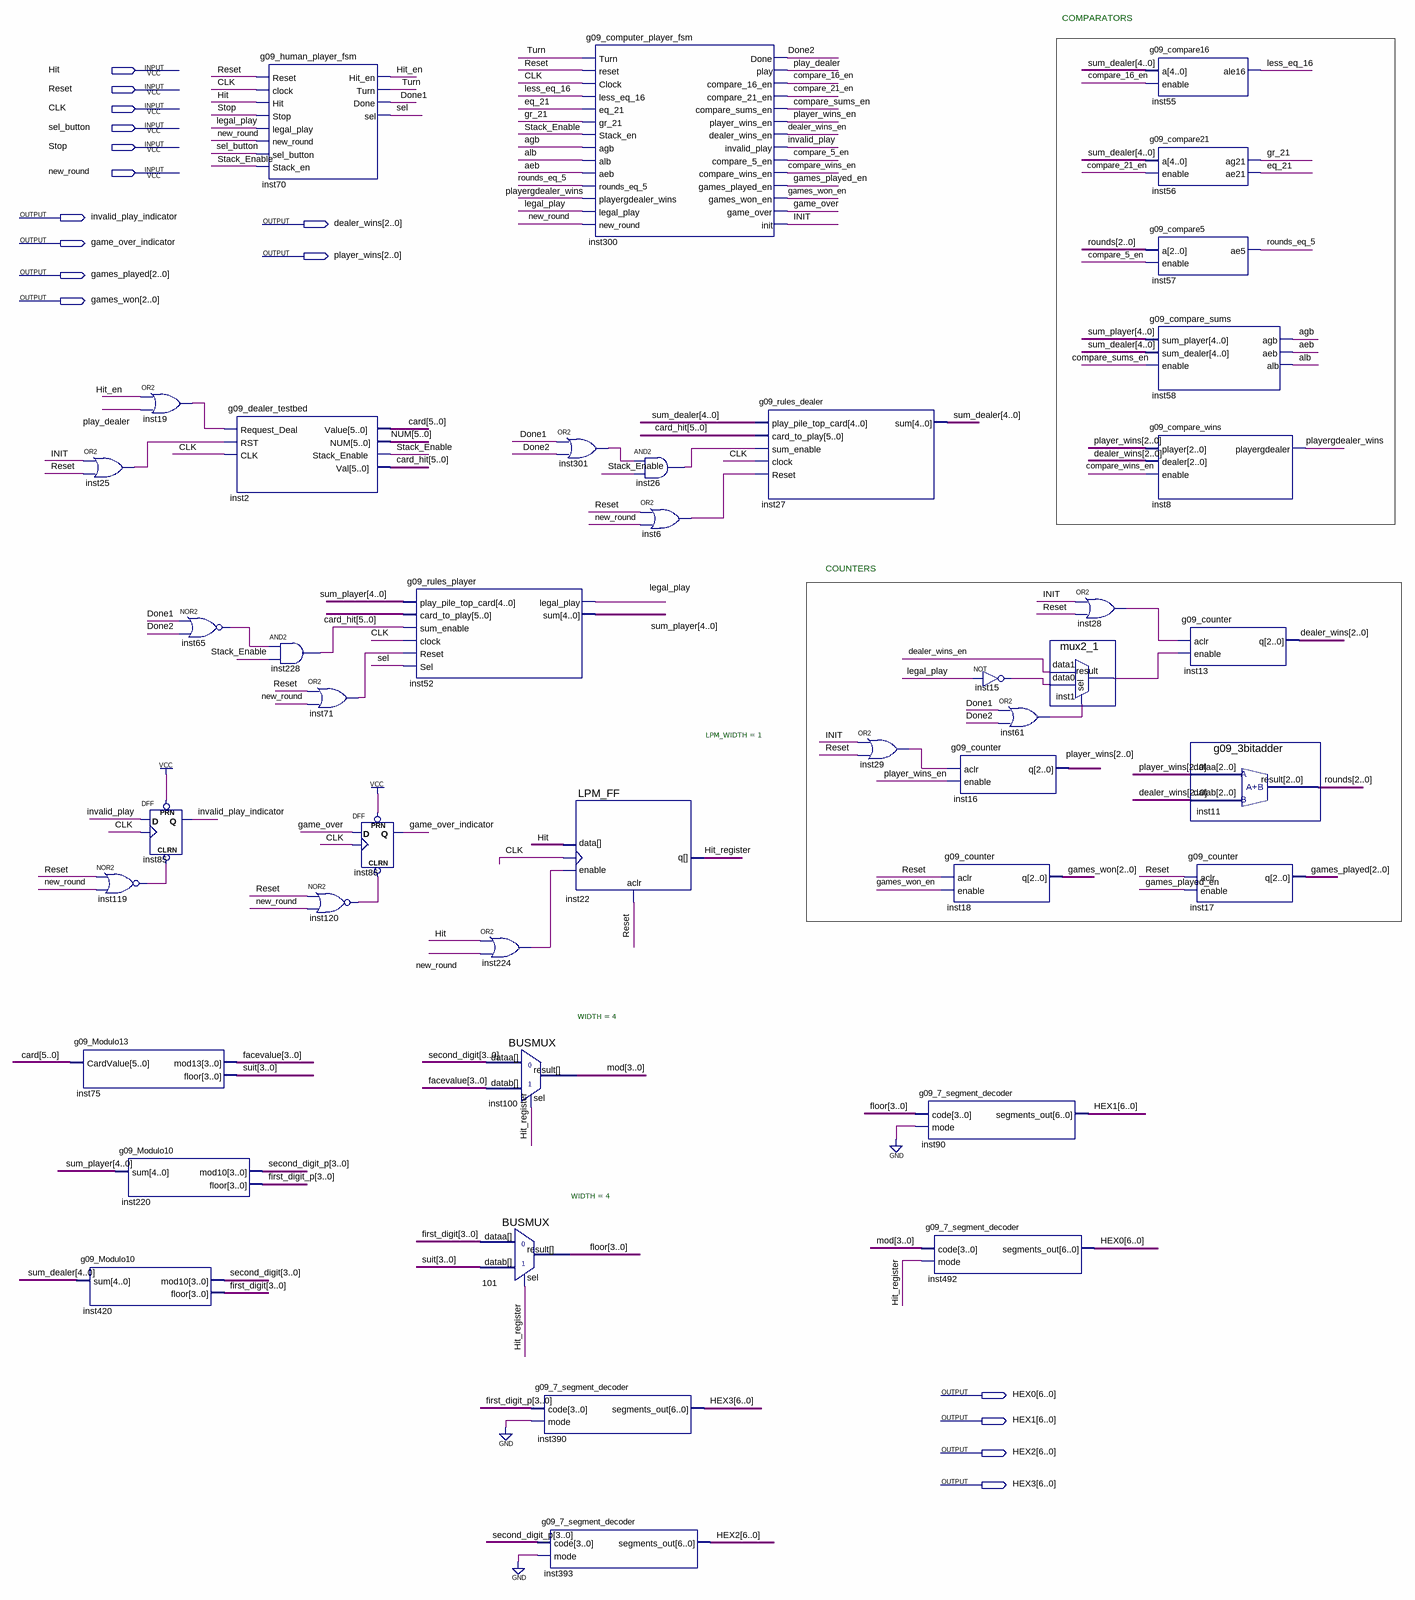
[diagram p0: schematic sheet]
// Quartus schematic g09_datapath.bdf as structural Verilog: 43 symbols, 16 pins
module g09_datapath (
  input  Hit,
  input  Reset,
  input  CLK,
  input  sel_button,
  input  Stop,
  input  new_round,
  output invalid_play_indicator,
  output [2:0] dealer_wins,
  output game_over_indicator,
  output [2:0] player_wins,
  output [2:0] games_played,
  output [2:0] games_won,
  output [6:0] HEX0,
  output [6:0] HEX1,
  output [6:0] HEX2,
  output [6:0] HEX3
);

  wire aeb, agb, alb, compare_5_en, compare_16_en, compare_21_en, compare_sums_en, compare_wins_en,
       dealer_wins_en, Done1, Done2, eq_21, game_over, games_played_en, games_won_en, gr_21, Hit_en,
       Hit_register, INIT, inst1_result, inst6_out, inst15_out, inst19_out, inst25_out, inst26_out,
       inst28_out, inst29_out, inst61_out, inst65_out, inst71_out, inst119_out, inst120_out, inst224_out,
       inst228_out, inst301_out, invalid_play, legal_play, less_eq_16, play_dealer, player_wins_en,
       playergdealer_wins, rounds_eq_5, sel, Stack_Enable, Turn;
  wire [2:0] rounds;
  wire [3:0] facevalue, first_digit, first_digit_p, floor, mod, second_digit, second_digit_p, suit;
  wire [4:0] sum_dealer, sum_player;
  wire [5:0] card, card_hit, NUM;

  or inst25 (inst25_out, INIT, Reset);
  g09_Modulo13 inst75 (.CardValue(card), .mod13(facevalue), .floor(suit));
  g09_Modulo10 inst420 (.sum(sum_dealer), .mod10(second_digit), .floor(first_digit));
  nor inst119 (inst119_out, Reset, new_round);
  g09_Modulo10 inst220 (.sum(sum_player), .mod10(second_digit_p), .floor(first_digit_p));
  or inst19 (inst19_out, Hit_en, play_dealer);
  nor inst65 (inst65_out, Done1, Done2);
  DFF inst85 (.CLRN(inst119_out), .CLK(CLK), .D(invalid_play), .PRN(1'b1), .Q(invalid_play_indicator));
  g09_dealer_testbed inst2 (
    .Request_Deal(inst19_out), .RST(inst25_out), .CLK(CLK), .Value(card), .NUM(NUM),
    .Stack_Enable(Stack_Enable), .Val(card_hit));
  g09_human_player_fsm inst70 (
    .Reset(Reset), .clock(CLK), .Hit(Hit), .Stop(Stop), .legal_play(legal_play), .new_round(new_round),
    .sel_button(sel_button), .Stack_en(Stack_Enable), .Hit_en(Hit_en), .Turn(Turn), .Done(Done1), .sel(sel));
  and inst228 (inst228_out, inst65_out, Stack_Enable);
  or inst71 (inst71_out, Reset, new_round);
  nor inst120 (inst120_out, Reset, new_round);
  DFF inst86 (.CLRN(inst120_out), .CLK(CLK), .D(game_over), .PRN(1'b1), .Q(game_over_indicator));
  g09_rules_player inst52 (
    .play_pile_top_card(sum_player), .card_to_play(card_hit), .sum_enable(inst228_out), .clock(CLK),
    .Reset(inst71_out), .Sel(sel), .legal_play(legal_play), .sum(sum_player));
  or inst224 (inst224_out, Hit, new_round);
  BUSMUX #(.WIDTH(4)) inst100 (.datab(facevalue), .sel(Hit_register), .dataa(second_digit), .result(mod));
  BUSMUX #(.WIDTH(4)) u_101 (.datab(suit), .sel(Hit_register), .dataa(first_digit), .result(floor));
  g09_7_segment_decoder inst390 (.code(first_digit_p), .mode(1'b0), .segments_out(HEX3));
  g09_7_segment_decoder inst393 (.code(second_digit_p), .mode(1'b0), .segments_out(HEX2));
  g09_computer_player_fsm inst300 (
    .Turn(Turn), .reset(Reset), .Clock(CLK), .less_eq_16(less_eq_16), .eq_21(eq_21), .gr_21(gr_21),
    .Stack_en(Stack_Enable), .agb(agb), .alb(alb), .aeb(aeb), .rounds_eq_5(rounds_eq_5),
    .playergdealer_wins(playergdealer_wins), .legal_play(legal_play), .new_round(new_round), .Done(Done2),
    .play(play_dealer), .compare_16_en(compare_16_en), .compare_21_en(compare_21_en),
    .compare_sums_en(compare_sums_en), .player_wins_en(player_wins_en), .dealer_wins_en(dealer_wins_en),
    .invalid_play(invalid_play), .compare_5_en(compare_5_en), .compare_wins_en(compare_wins_en),
    .games_played_en(games_played_en), .games_won_en(games_won_en), .game_over(game_over), .init(INIT));
  or inst301 (inst301_out, Done1, Done2);
  LPM_FF #(.LPM_WIDTH(1)) inst22 (.aclr(Reset), .clock(CLK), .data(Hit), .enable(inst224_out), .q(Hit_register));
  and inst26 (inst26_out, inst301_out, Stack_Enable);
  or inst6 (inst6_out, Reset, new_round);
  g09_rules_dealer inst27 (
    .play_pile_top_card(sum_dealer), .card_to_play(card_hit), .sum_enable(inst26_out), .clock(CLK),
    .Reset(inst6_out), .sum(sum_dealer));
  or inst29 (inst29_out, INIT, Reset);
  g09_counter inst16 (.aclr(inst29_out), .enable(player_wins_en), .q(player_wins));
  g09_counter inst18 (.aclr(Reset), .enable(games_won_en), .q(games_won));
  g09_7_segment_decoder inst90 (.code(floor), .mode(1'b0), .segments_out(HEX1));
  g09_7_segment_decoder inst492 (.code(mod), .mode(Hit_register), .segments_out(HEX0));
  not inst15 (inst15_out, legal_play);
  or inst61 (inst61_out, Done1, Done2);
  mux2_1 inst1 (.data1(dealer_wins_en), .data0(inst15_out), .sel(inst61_out), .result(inst1_result));
  or inst28 (inst28_out, INIT, Reset);
  g09_compare16 inst55 (.a(sum_dealer), .enable(compare_16_en), .ale16(less_eq_16));
  g09_compare21 inst56 (.a(sum_dealer), .enable(compare_21_en), .ag21(gr_21), .ae21(eq_21));
  g09_compare5 inst57 (.a(rounds), .enable(compare_5_en), .ae5(rounds_eq_5));
  g09_compare_sums inst58 (
    .sum_player(sum_player), .sum_dealer(sum_dealer), .enable(compare_sums_en), .agb(agb), .aeb(aeb),
    .alb(alb));
  g09_compare_wins inst8 (
    .player(player_wins), .dealer(dealer_wins), .enable(compare_wins_en), .playergdealer(playergdealer_wins));
  g09_counter inst13 (.aclr(inst28_out), .enable(inst1_result), .q(dealer_wins));
  g09_3bitadder inst11 (.dataa(player_wins), .datab(dealer_wins), .result(rounds));
  g09_counter inst17 (.aclr(Reset), .enable(games_played_en), .q(games_played));

  // Notes on the sheet:
  //   COMPARATORS
  //   COUNTERS
endmodule
